# EasyEDA Pro project ProProject_赤兔主板（夜燕flex）111_2024-08-22.epro, board a28_t2g4a27d1a
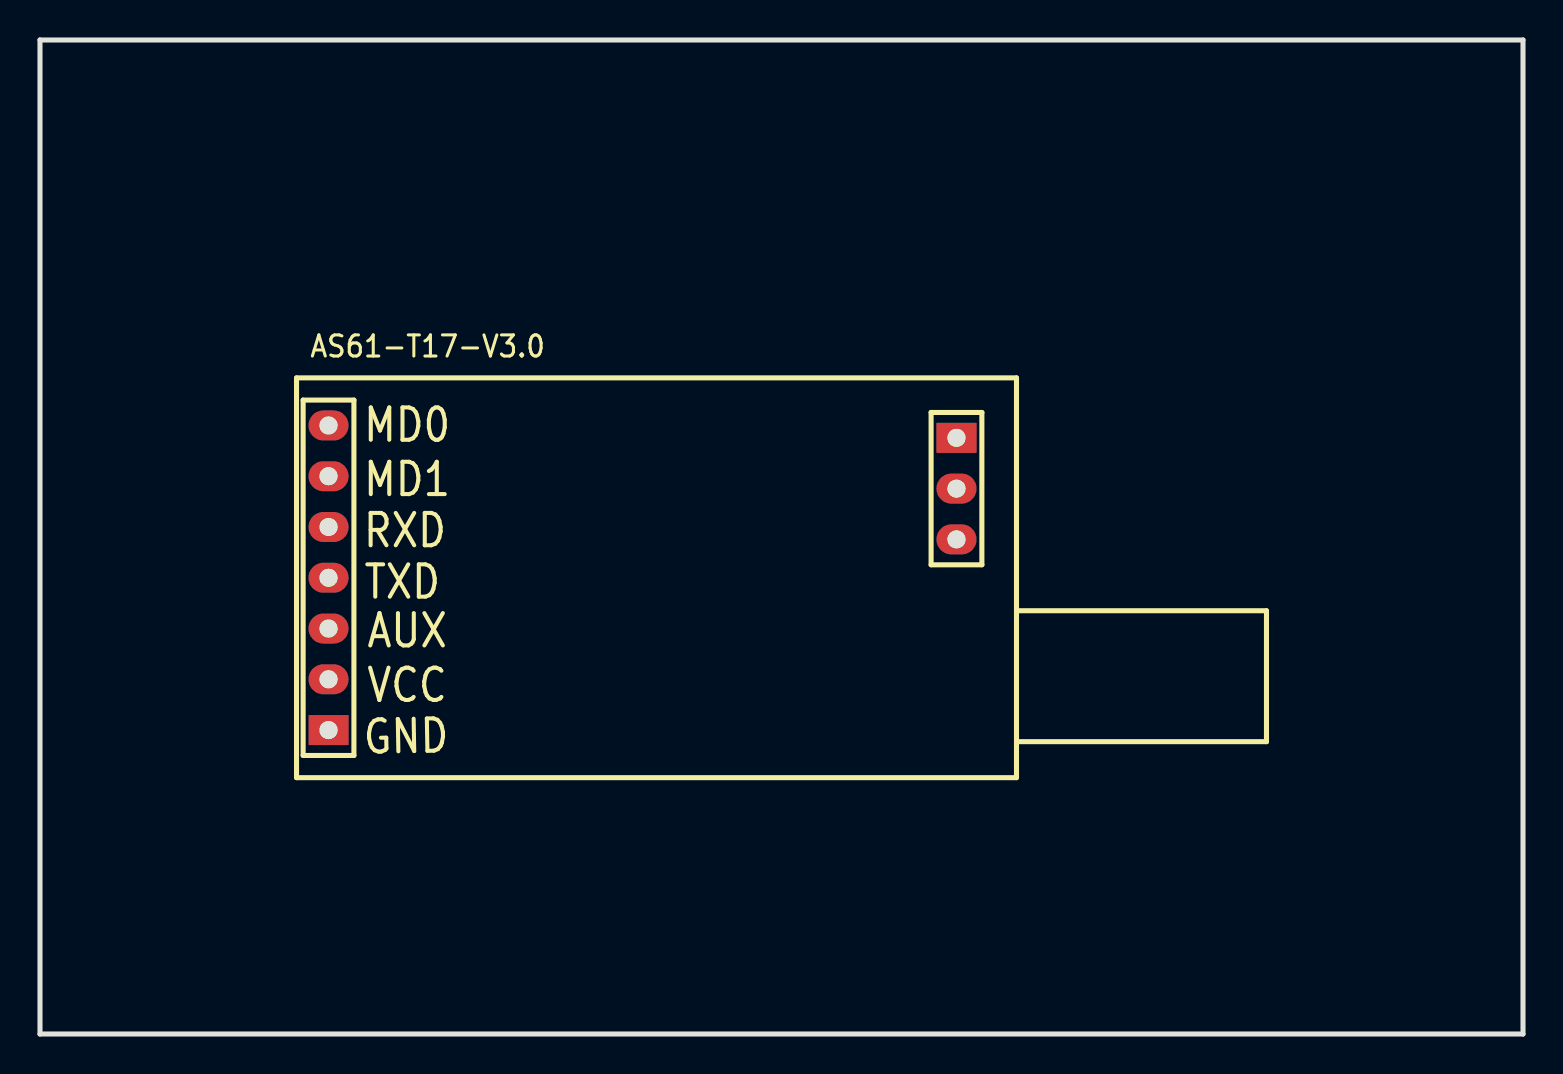
[diagram p4: board, top side]
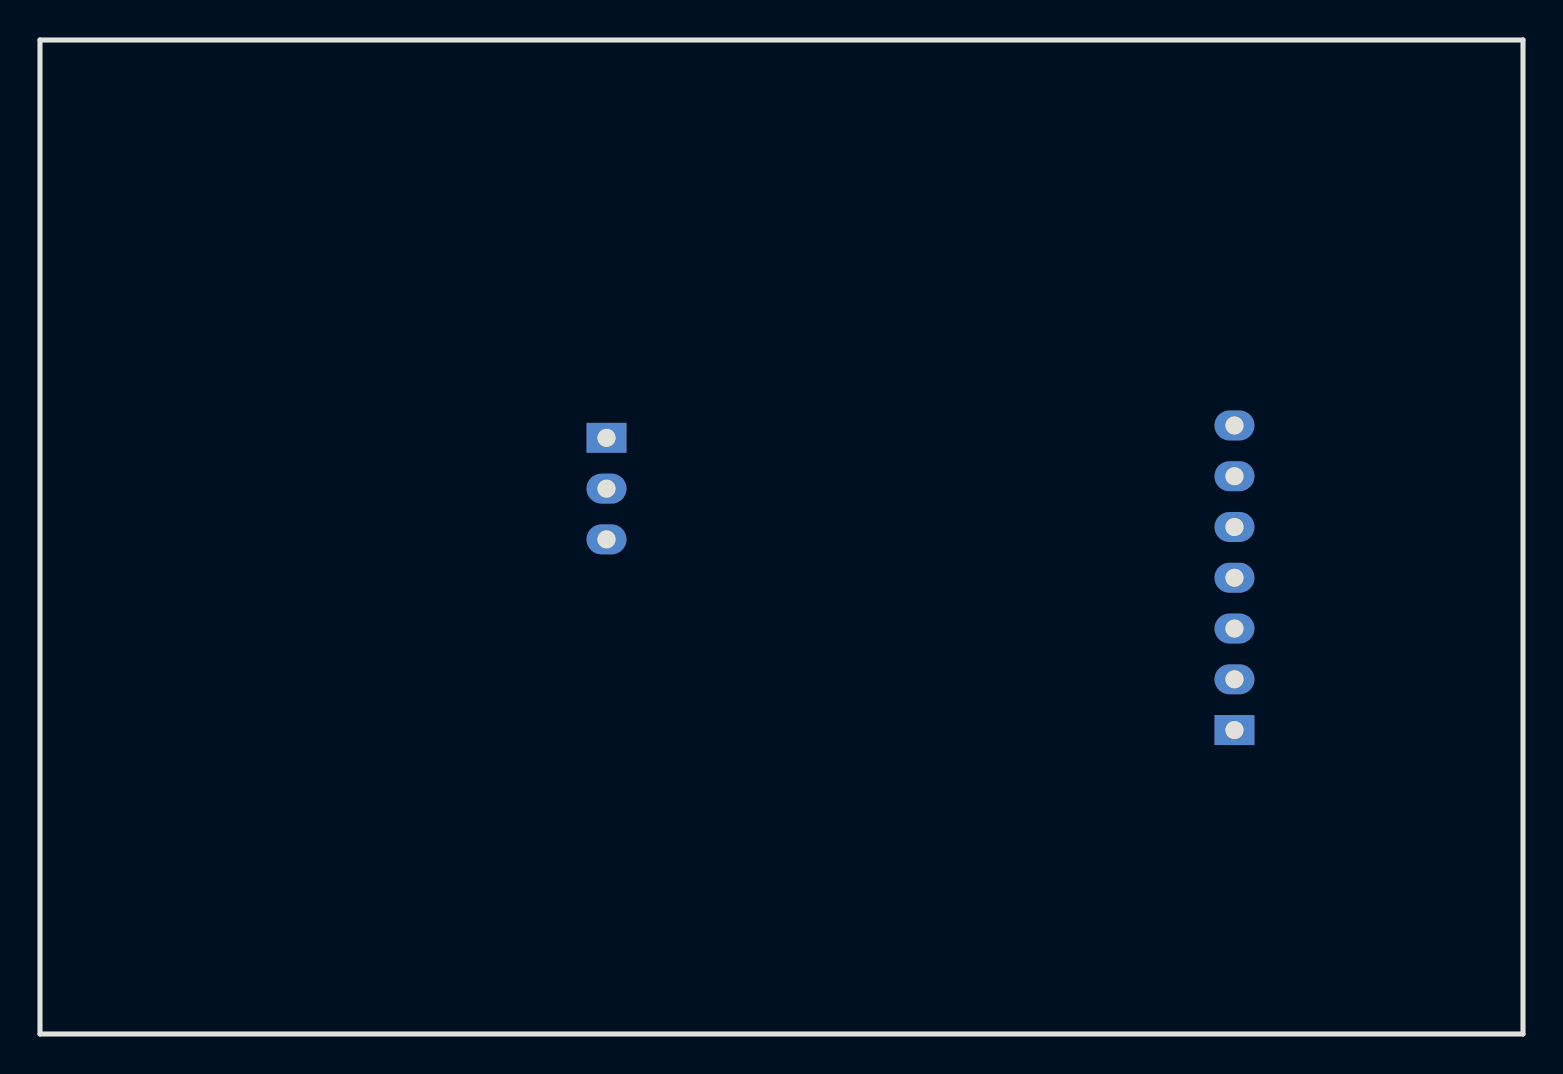
[diagram p5: board, bottom side, seen from below]

Outline 74.15 x 49.73 mm; copper layers: Top Layer, Bottom Layer. Coordinates in mm from the lower left corner of the outline.
Outline path: 0,49.73 74.15,49.73 74.15,0 0,0 0,49.73

## Placement (name value [footprint] x y rotation side)
AS61-T17-V3.0  -  [HEADER1X7-2.54MM]  14.43 15.21 0 top
J2  -  [HEADER1X3-2.54MM]  45.83 29.83 180 top

## Footprints (pads in the part's own frame, mm; a bottom-side part is the same pattern mirrored in y, then rotated)
HEADER1X3-2.54MM
  rect 2x1.5 hole 0.905x0.9: 1(0,0)
  oval 2x1.5 hole 0.905x0.9: 2(0,2.54) 3(0,5.08)
HEADER1X7-2.54MM
  rect 2x1.5 hole 0.905x0.9: 1(0,0)
  oval 2x1.5 hole 0.905x0.9: 2(0,2.54) 3(0,5.08) 4(0,7.62) 5(0,10.16) 6(0,12.7) 7(0,15.24)

## Nets

Pads without a net: AS61-T17-V3.0 1 2 3 4 5 6 7; J2 1 2 3

## Text on the board
Top Silkscreen Layer: RXD | MD0 | MD1 | TXD | VCC | AUX | GND
